# Altium project PCB_Project.PrjPcb
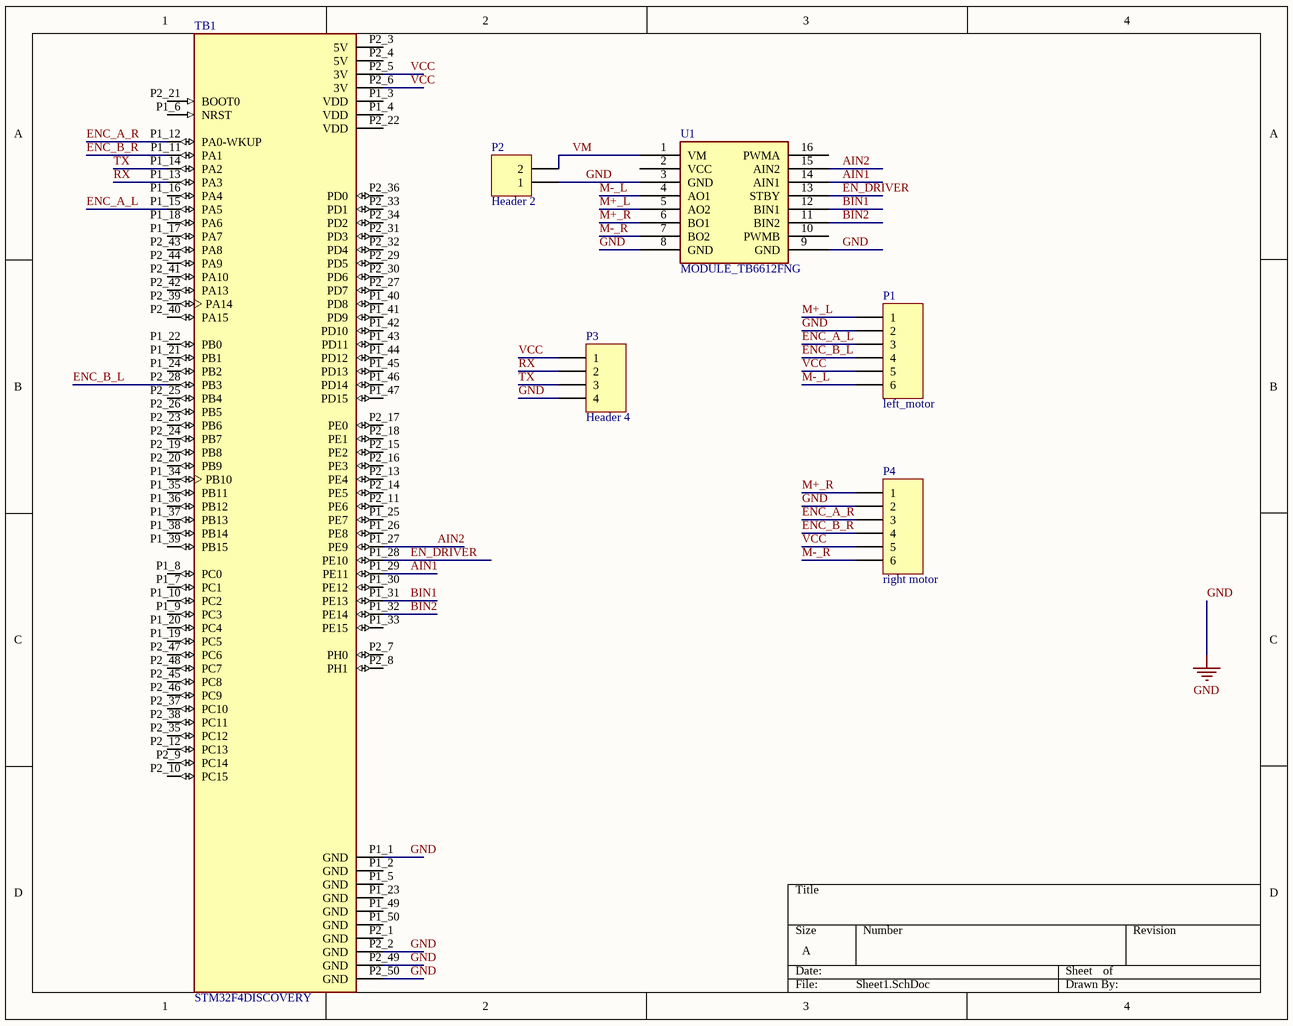
[diagram p0: Sheet1.SchDoc]
1 sheet, 6 parts. Net scope: global (net labels, ports and power ports of the same name join across sheets).
Board file: PCB1.PcbDoc

## Sheet Sheet1.SchDoc
size A; SheetNumber: 1; SheetTotal: 1

### Parts
P1  left_motor  [HDR1X6]
P2  Header 2  [HDR1X2]
P3  Header 4  [HDR1X4]
P4  right motor  [HDR1X6]
TB1  STM32F4DISCOVERY  [MODULE_STM32F4DISCOVERY]
U1  MODULE_TB6612FNG  [MODULE_TB6612FNG]

### Nets
GND: P1.2 P2.1 P3.4 P4.2 TB1.P1_1(GND) TB1.P2_2(GND) TB1.P2_49(GND) TB1.P2_50(GND) U1.3(GND) U1.8(GND) U1.9(GND)
AIN1: TB1.P1_29(PE11) U1.14(AIN1)
AIN2: TB1.P1_27(PE9) U1.15(AIN2)
BIN1: TB1.P1_31(PE13) U1.12(BIN1)
BIN2: TB1.P1_32(PE14) U1.11(BIN2)
EN_DRIVER: TB1.P1_28(PE10) U1.13(STBY)
ENC_A_L: P1.3 TB1.P1_15(PA5)
ENC_A_R: P4.3 TB1.P1_12(PA0-WKUP)
ENC_B_L: P1.4 TB1.P2_28(PB3)
ENC_B_R: P4.4 TB1.P1_11(PA1)
M+_L: P1.1 U1.5(AO2)
M+_R: P4.1 U1.6(BO1)
M-_L: P1.6 U1.4(AO1)
M-_R: P4.6 U1.7(BO2)
RX: P3.2 TB1.P1_13(PA3)
TX: P3.3 TB1.P1_14(PA2)
VCC: P1.5 P3.1 P4.5 TB1.P2_5(3V) TB1.P2_6(3V)
VM: P2.2 U1.1(VM)

Not connected (* = marked no-connect by the designer): TB1 P1_2(GND) P1_3(VDD) P1_4(VDD) P1_5(GND) P1_6(NRST) P1_7(PC1) P1_8(PC0) P1_9(PC3) P1_10(PC2) P1_16(PA4) P1_17(PA7) P1_18(PA6) P1_19(PC5) P1_20(PC4) P1_21(PB1) P1_22(PB0) P1_23(GND) P1_24(PB2) P1_25(PE7) P1_26(PE8) P1_30(PE12) P1_33(PE15) P1_34(PB10) P1_35(PB11) P1_36(PB12) P1_37(PB13) P1_38(PB14) P1_39(PB15) P1_40(PD8) P1_41(PD9) P1_42(PD10) P1_43(PD11) P1_44(PD12) P1_45(PD13) P1_46(PD14) P1_47(PD15) P1_49(GND) P1_50(GND) P2_1(GND) P2_3(5V) P2_4(5V) P2_7(PH0) P2_8(PH1) P2_9(PC14) P2_10(PC15) P2_11(PE6) P2_12(PC13) P2_13(PE4) P2_14(PE5) P2_15(PE2) P2_16(PE3) P2_17(PE0) P2_18(PE1) P2_19(PB8) P2_20(PB9) P2_21(BOOT0) P2_22(VDD) P2_23(PB6) P2_24(PB7) P2_25(PB4) P2_26(PB5) P2_27(PD7) P2_29(PD5) P2_30(PD6) P2_31(PD3) P2_32(PD4) P2_33(PD1) P2_34(PD2) P2_35(PC12) P2_36(PD0) P2_37(PC10) P2_38(PC11) P2_39(PA14) P2_40(PA15) P2_41(PA10) P2_42(PA13) P2_43(PA8) P2_44(PA9) P2_45(PC8) P2_46(PC9) P2_47(PC6) P2_48(PC7); U1 2(VCC) 10(PWMB) 16(PWMA)

### Library data of the parts
P1 P4 = Header 6: Header, 6-Pin; LatestRevisionDate: 17-Jul-2002; LatestRevisionNote: Re-released for DXP Platform.; Publisher: Altium Limited
P2 = Header 2: Header, 2-Pin; LatestRevisionDate: 17-Jul-2002; LatestRevisionNote: Re-released for DXP Platform.; Publisher: Altium Limited
P3 = Header 4: Header, 4-Pin; LatestRevisionDate: 17-Jul-2002; LatestRevisionNote: Re-released for DXP Platform.; Publisher: Altium Limited
TB1 = STM32F4DISCOVERY: Development kit: ARM ST; pin strips, pin header; No.of; Availability: Unavailable; MP: STM32F4DISCOVERY; Value: *; Price: None; Package: None
U1 = MODULE_TB6612FNG: Module Dual Motor Driver 2.5-13.5V 3.2A Peak 21x18mm; ComponentLink1Description: Datasheet; ComponentLink1URL: https://www.mouser.com/datasheet/2/408/TB6612FNG_datasheet_en_20141001-708260.pdf